# EAGLE design Wiring Harness Validator MX150L Rev1 (EAGLE 8.3.1)
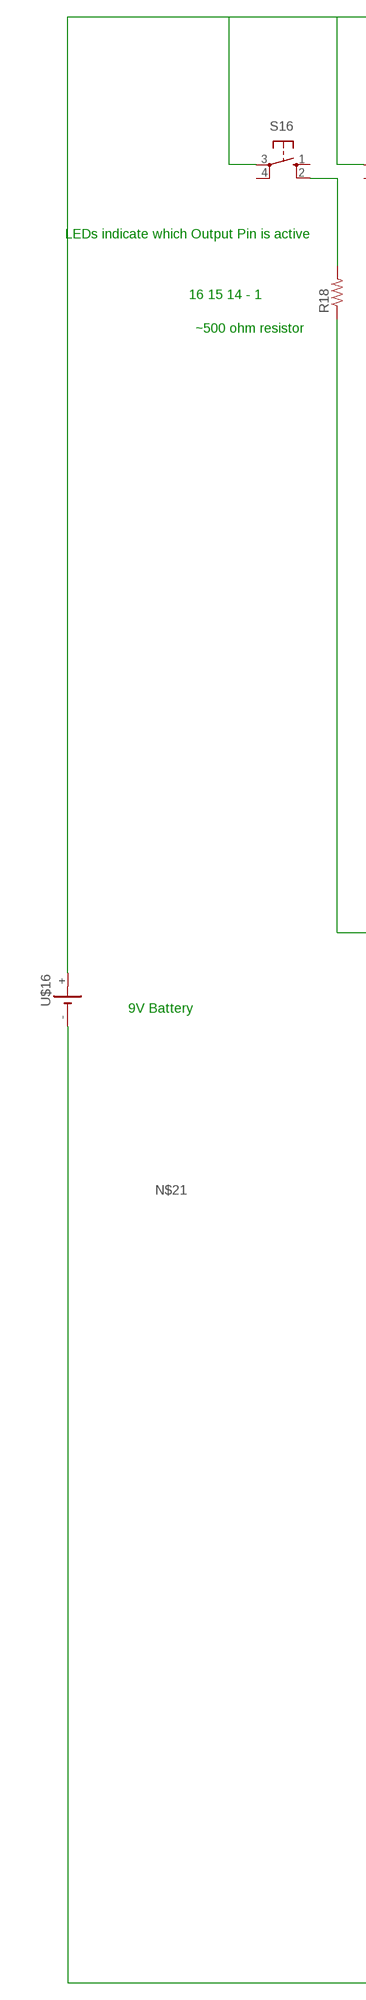
[diagram p0: schematic, sheet 1, part 1 of 2]
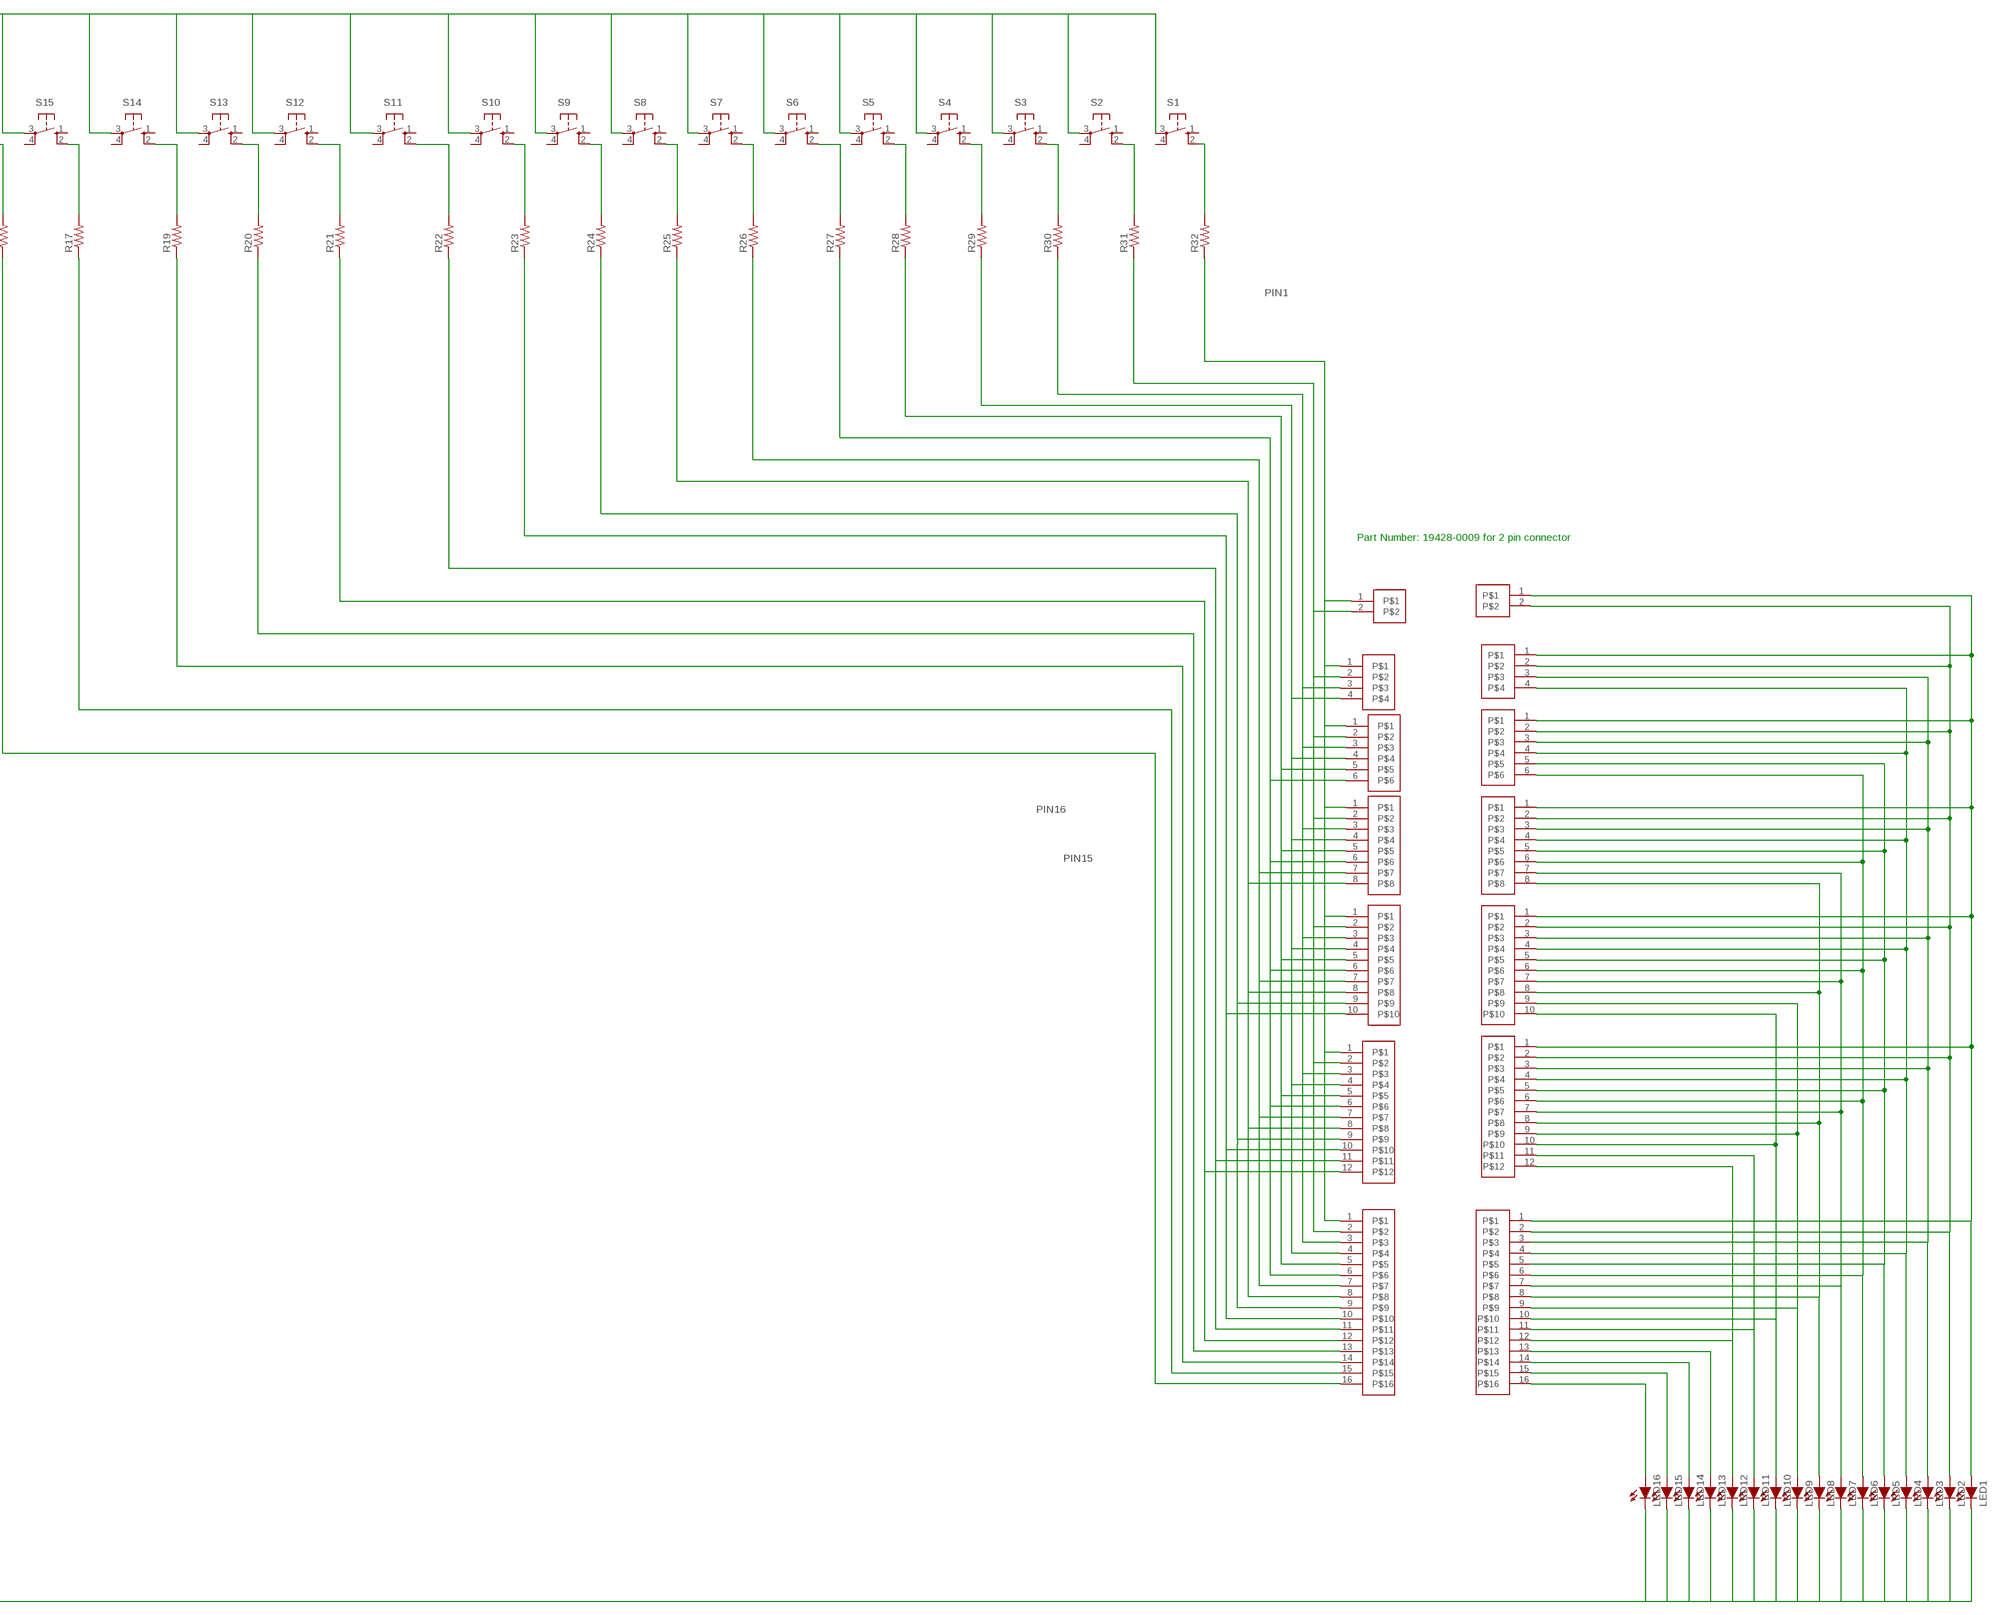
[diagram p1: schematic, sheet 1, part 2 of 2]

## Parts
LED1  LED-5MM  [LED-5MM]
LED2  LED-5MM  [LED-5MM]
LED3  LED-5MM  [LED-5MM]
LED4  LED-5MM  [LED-5MM]
LED5  LED-5MM  [LED-5MM]
LED6  LED-5MM  [LED-5MM]
LED7  LED-5MM  [LED-5MM]
LED8  LED-5MM  [LED-5MM]
LED9  LED-5MM  [LED-5MM]
LED10  LED-5MM  [LED-5MM]
LED11  LED-5MM  [LED-5MM]
LED12  LED-5MM  [LED-5MM]
LED13  LED-5MM  [LED-5MM]
LED14  LED-5MM  [LED-5MM]
LED15  LED-5MM  [LED-5MM]
LED16  LED-5MM  [LED-5MM]
R17  RESISTORPTH-1/2W  [AXIAL-0.5]
R18  RESISTORPTH-1/2W  [AXIAL-0.5]
R19  RESISTORPTH-1/2W  [AXIAL-0.5]
R20  RESISTORPTH-1/2W  [AXIAL-0.5]
R21  RESISTORPTH-1/2W  [AXIAL-0.5]
R22  RESISTORPTH-1/2W  [AXIAL-0.5]
R23  RESISTORPTH-1/2W  [AXIAL-0.5]
R24  RESISTORPTH-1/2W  [AXIAL-0.5]
R25  RESISTORPTH-1/2W  [AXIAL-0.5]
R26  RESISTORPTH-1/2W  [AXIAL-0.5]
R27  RESISTORPTH-1/2W  [AXIAL-0.5]
R28  RESISTORPTH-1/2W  [AXIAL-0.5]
R29  RESISTORPTH-1/2W  [AXIAL-0.5]
R30  RESISTORPTH-1/2W  [AXIAL-0.5]
R31  RESISTORPTH-1/2W  [AXIAL-0.5]
R32  RESISTORPTH-1/2W  [AXIAL-0.5]
S1  BTN_10-XX  [B3F-10XX]
S2  BTN_10-XX  [B3F-10XX]
S3  BTN_10-XX  [B3F-10XX]
S4  BTN_10-XX  [B3F-10XX]
S5  BTN_10-XX  [B3F-10XX]
S6  BTN_10-XX  [B3F-10XX]
S7  BTN_10-XX  [B3F-10XX]
S8  BTN_10-XX  [B3F-10XX]
S9  BTN_10-XX  [B3F-10XX]
S10  BTN_10-XX  [B3F-10XX]
S11  BTN_10-XX  [B3F-10XX]
S12  BTN_10-XX  [B3F-10XX]
S13  BTN_10-XX  [B3F-10XX]
S14  BTN_10-XX  [B3F-10XX]
S15  BTN_10-XX  [B3F-10XX]
S16  BTN_10-XX  [B3F-10XX]
U$1  MX150L-4PINS  [MX150L_VERTICAL-4]
U$2  MX150L-6PINS  [MX150L_VERTICAL-6]
U$3  MX150L-2PINS  [MX150L_VERTICAL-2]
U$4  MX150L-8PINS  [MX150L_VERTICAL-8]
U$5  MX150L-10PINS  [MX150L_VERTICAL-10]
U$6  MX150L-12PINS  [MX150L_VERTICAL-12]
U$7  MX150L-16PINS  [MX150L-VERTICAL-16]
U$8  MX150L-16PINS  [MX150L-VERTICAL-16]
U$9  MX150L-12PINS  [MX150L_VERTICAL-12]
U$10  MX150L-10PINS  [MX150L_VERTICAL-10]
U$11  MX150L-8PINS  [MX150L_VERTICAL-8]
U$12  MX150L-6PINS  [MX150L_VERTICAL-6]
U$13  MX150L-4PINS  [MX150L_VERTICAL-4]
U$14  MX150L-2PINS  [MX150L_VERTICAL-2]
U$16  1291-79  [1291-79]

## Nets
GND: LED1.A U$8.1 U$9.1 U$10.1 U$11.1 U$12.1 U$13.1 U$14.1
N$1: S1.3(P) S2.3(P) S3.3(P) S4.3(P) S5.3(P) S6.3(P) S7.3(P) S8.3(P) S9.3(P) S10.3(P) S11.3(P) S12.3(P) S13.3(P) S14.3(P) S15.3(P) S16.3(P) U$16.+
N$3: LED16.A U$8.16
N$4: LED8.A U$8.8 U$9.8 U$10.8 U$11.8
N$7: LED15.A U$8.15
N$8: LED14.A U$8.14
N$9: LED13.A U$8.13
N$10: LED12.A U$8.12 U$9.12
N$11: LED11.A U$8.11 U$9.11
N$12: LED10.A U$8.10 U$9.10 U$10.10
N$13: LED9.A U$8.9 U$9.9 U$10.9
N$15: LED7.A U$8.7 U$9.7 U$10.7 U$11.7
N$16: LED6.A U$8.6 U$9.6 U$10.6 U$11.6 U$12.6
N$17: LED5.A U$8.5 U$9.5 U$10.5 U$11.5 U$12.5
N$18: LED4.A U$8.4 U$9.4 U$10.4 U$11.4 U$12.4 U$13.4
N$19: LED3.A U$8.3 U$9.3 U$10.3 U$11.3 U$12.3 U$13.3
N$20: LED2.A U$8.2 U$9.2 U$10.2 U$11.2 U$12.2 U$13.2 U$14.2
N$21: LED1.K(C) LED2.K(C) LED3.K(C) LED4.K(C) LED5.K(C) LED6.K(C) LED7.K(C) LED8.K(C) LED9.K(C) LED10.K(C) LED11.K(C) LED12.K(C) LED13.K(C) LED14.K(C) LED15.K(C) LED16.K(C) U$16.-
N$40: R32.P$2 S1.2(S1)
N$53: R31.P$2 S2.2(S1)
N$54: R30.P$2 S3.2(S1)
N$55: R29.P$2 S4.2(S1)
N$56: R28.P$2 S5.2(S1)
N$57: R27.P$2 S6.2(S1)
N$58: R26.P$2 S7.2(S1)
N$59: R25.P$2 S8.2(S1)
N$60: R24.P$2 S9.2(S1)
N$61: R23.P$2 S10.2(S1)
N$62: R22.P$2 S11.2(S1)
N$63: R21.P$2 S12.2(S1)
N$64: R20.P$2 S13.2(S1)
N$65: R19.P$2 S14.2(S1)
N$66: R17.P$2 S15.2(S1)
N$67: R18.P$2 S16.2(S1)
PIN1: R32.P$1 U$1.1 U$2.1 U$3.1 U$4.1 U$5.1 U$6.1 U$7.1
PIN2: R31.P$1 U$1.2 U$2.2 U$3.2 U$4.2 U$5.2 U$6.2 U$7.2
PIN3: R30.P$1 U$1.3 U$2.3 U$4.3 U$5.3 U$6.3 U$7.3
PIN4: R29.P$1 U$1.4 U$2.4 U$4.4 U$5.4 U$6.4 U$7.4
PIN5: R28.P$1 U$2.5 U$4.5 U$5.5 U$6.5 U$7.5
PIN6: R27.P$1 U$2.6 U$4.6 U$5.6 U$6.6 U$7.6
PIN7: R26.P$1 U$4.7 U$5.7 U$6.7 U$7.7
PIN8: R25.P$1 U$4.8 U$5.8 U$6.8 U$7.8
PIN9: R24.P$1 U$5.9 U$6.9 U$7.9
PIN10: R23.P$1 U$5.10 U$6.10 U$7.10
PIN11: R22.P$1 U$6.11 U$7.11
PIN12: R21.P$1 U$6.12 U$7.12
PIN13: R20.P$1 U$7.13
PIN14: R19.P$1 U$7.14
PIN15: R17.P$1 U$7.15
PIN16: R18.P$1 U$7.16
Unconnected: S1.1(S) S1.4(P1) S2.1(S) S2.4(P1) S3.1(S) S3.4(P1) S4.1(S) S4.4(P1) S5.1(S) S5.4(P1) S6.1(S) S6.4(P1) S7.1(S) S7.4(P1) S8.1(S) S8.4(P1) S9.1(S) S9.4(P1) S10.1(S) S10.4(P1) S11.1(S) S11.4(P1) S12.1(S) S12.4(P1) S13.1(S) S13.4(P1) S14.1(S) S14.4(P1) S15.1(S) S15.4(P1) S16.1(S) S16.4(P1)

## Notes on the sheet
- LEDs indicate which Output Pin is active
- 16 15 14 - 1
- ~500 ohm resistor
- Part Number: 19428-0009 for 2 pin connector
- 9V Battery

## Library data of the parts
LED1-LED16 = HyTechDevices:LED: Light Emitting Diode (LED) Source: Dangerous Prototypes Eagle Library <https://github.com/DangerousPrototypes/Eagle_Part_Library>
R17-R32 = HyTechDevices:RESISTOR: Resistor Basic schematic elements and footprints for 0603, 1206, and PTH resistors.
S1-S16 = HyTechDevices:BTN_10-XX: Small momentary tactile push button; MPN: B3F-1000; OC_FARNELL: 176432; OC_NEWARK: 36M3542
U$1 U$13 = HyTechDevices:MX150L-4PINS
U$2 U$12 = HyTechDevices:MX150L-6PINS
U$3 U$14 = HyTechDevices:MX150L-2PINS
U$4 U$11 = HyTechDevices:MX150L-8PINS
U$5 U$10 = HyTechDevices:MX150L-10PINS
U$6 U$9 = HyTechDevices:MX150L-12PINS
U$7 U$8 = HyTechDevices:MX150L-16PINS
U$16 = HyTechDevices:1291-79: Keystone Electronics 9V 9 Volt battery holder 1291-79

## Board
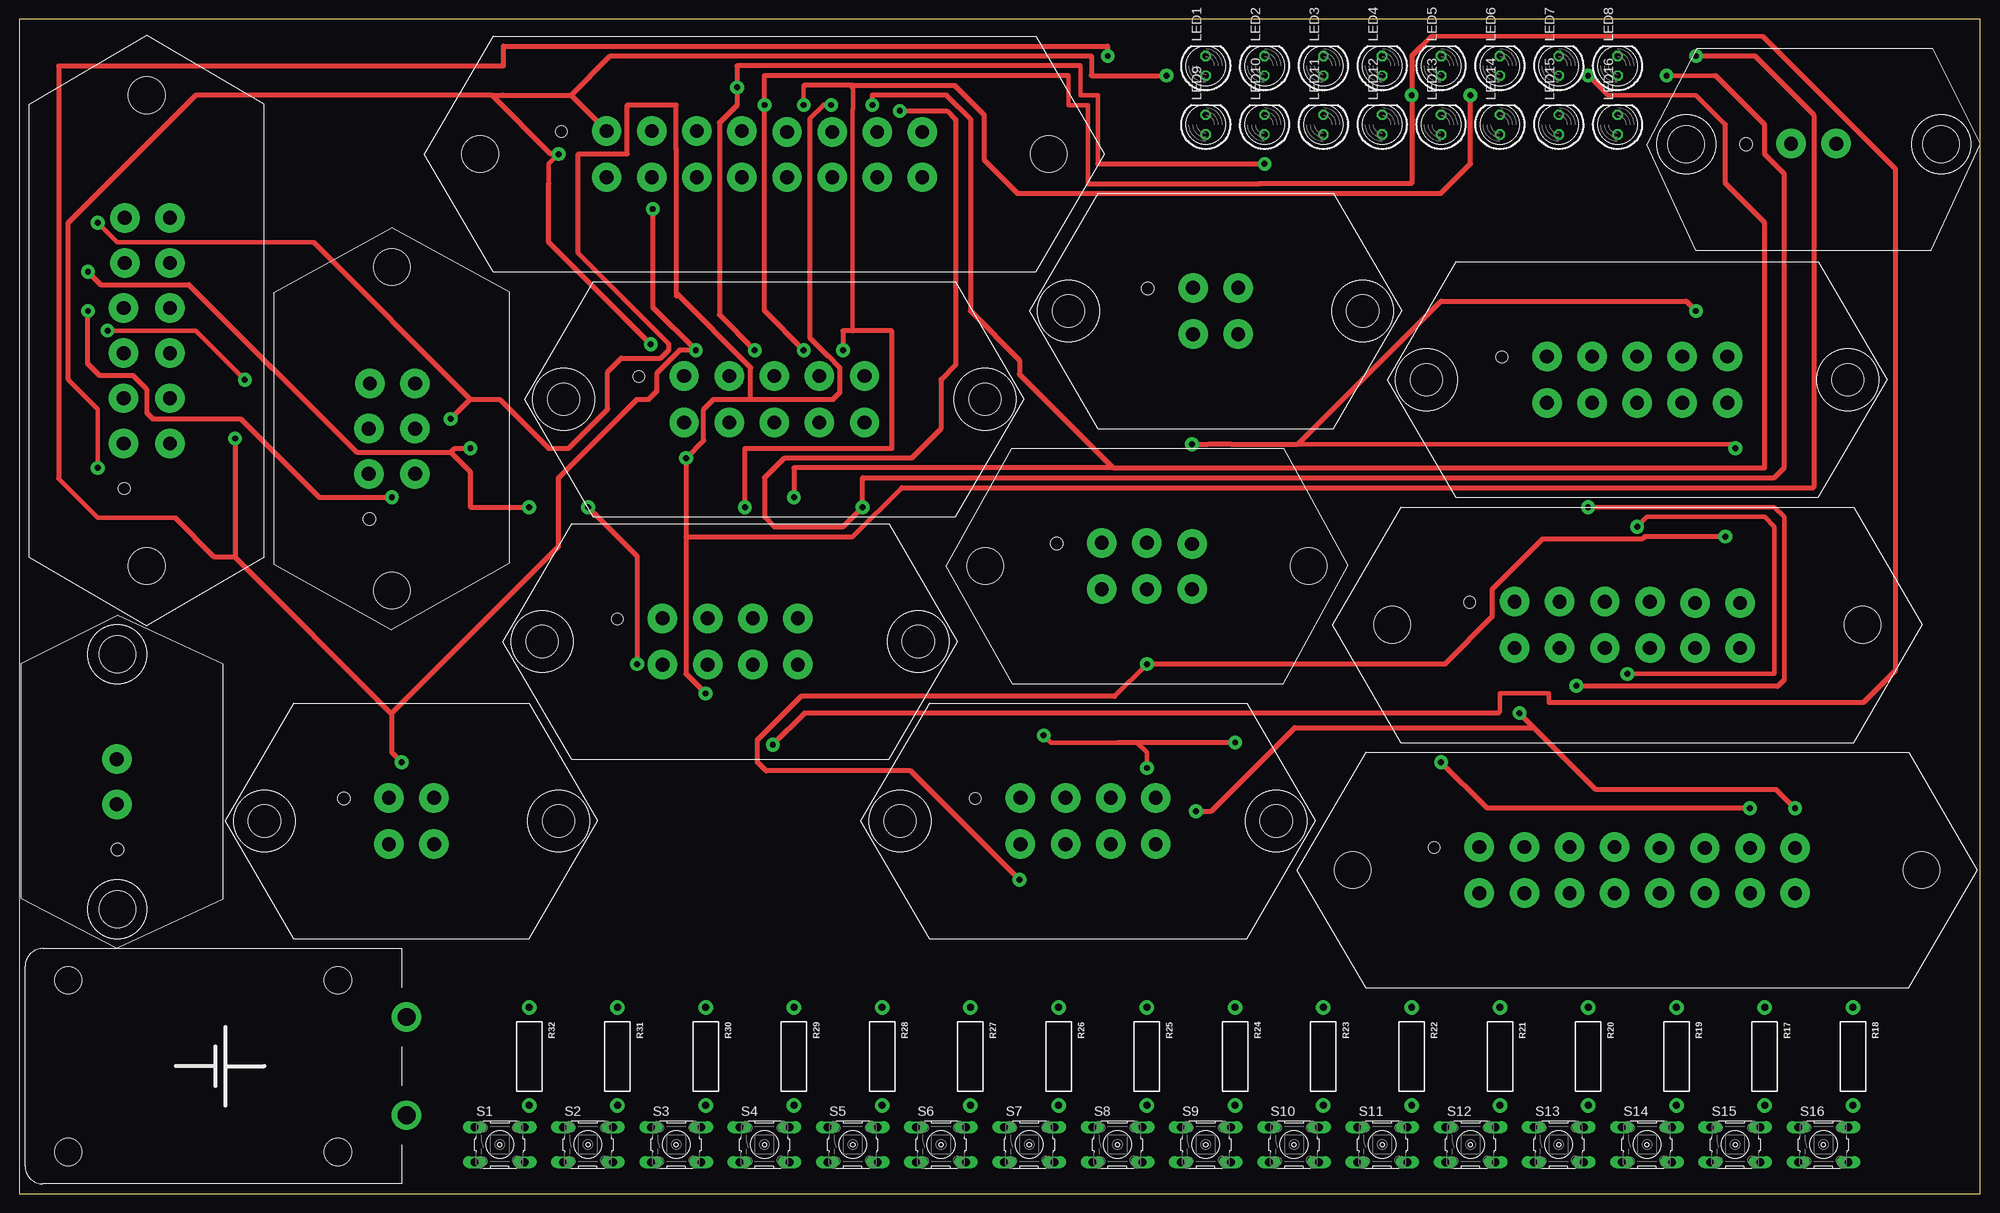
[diagram p2: board, top side]
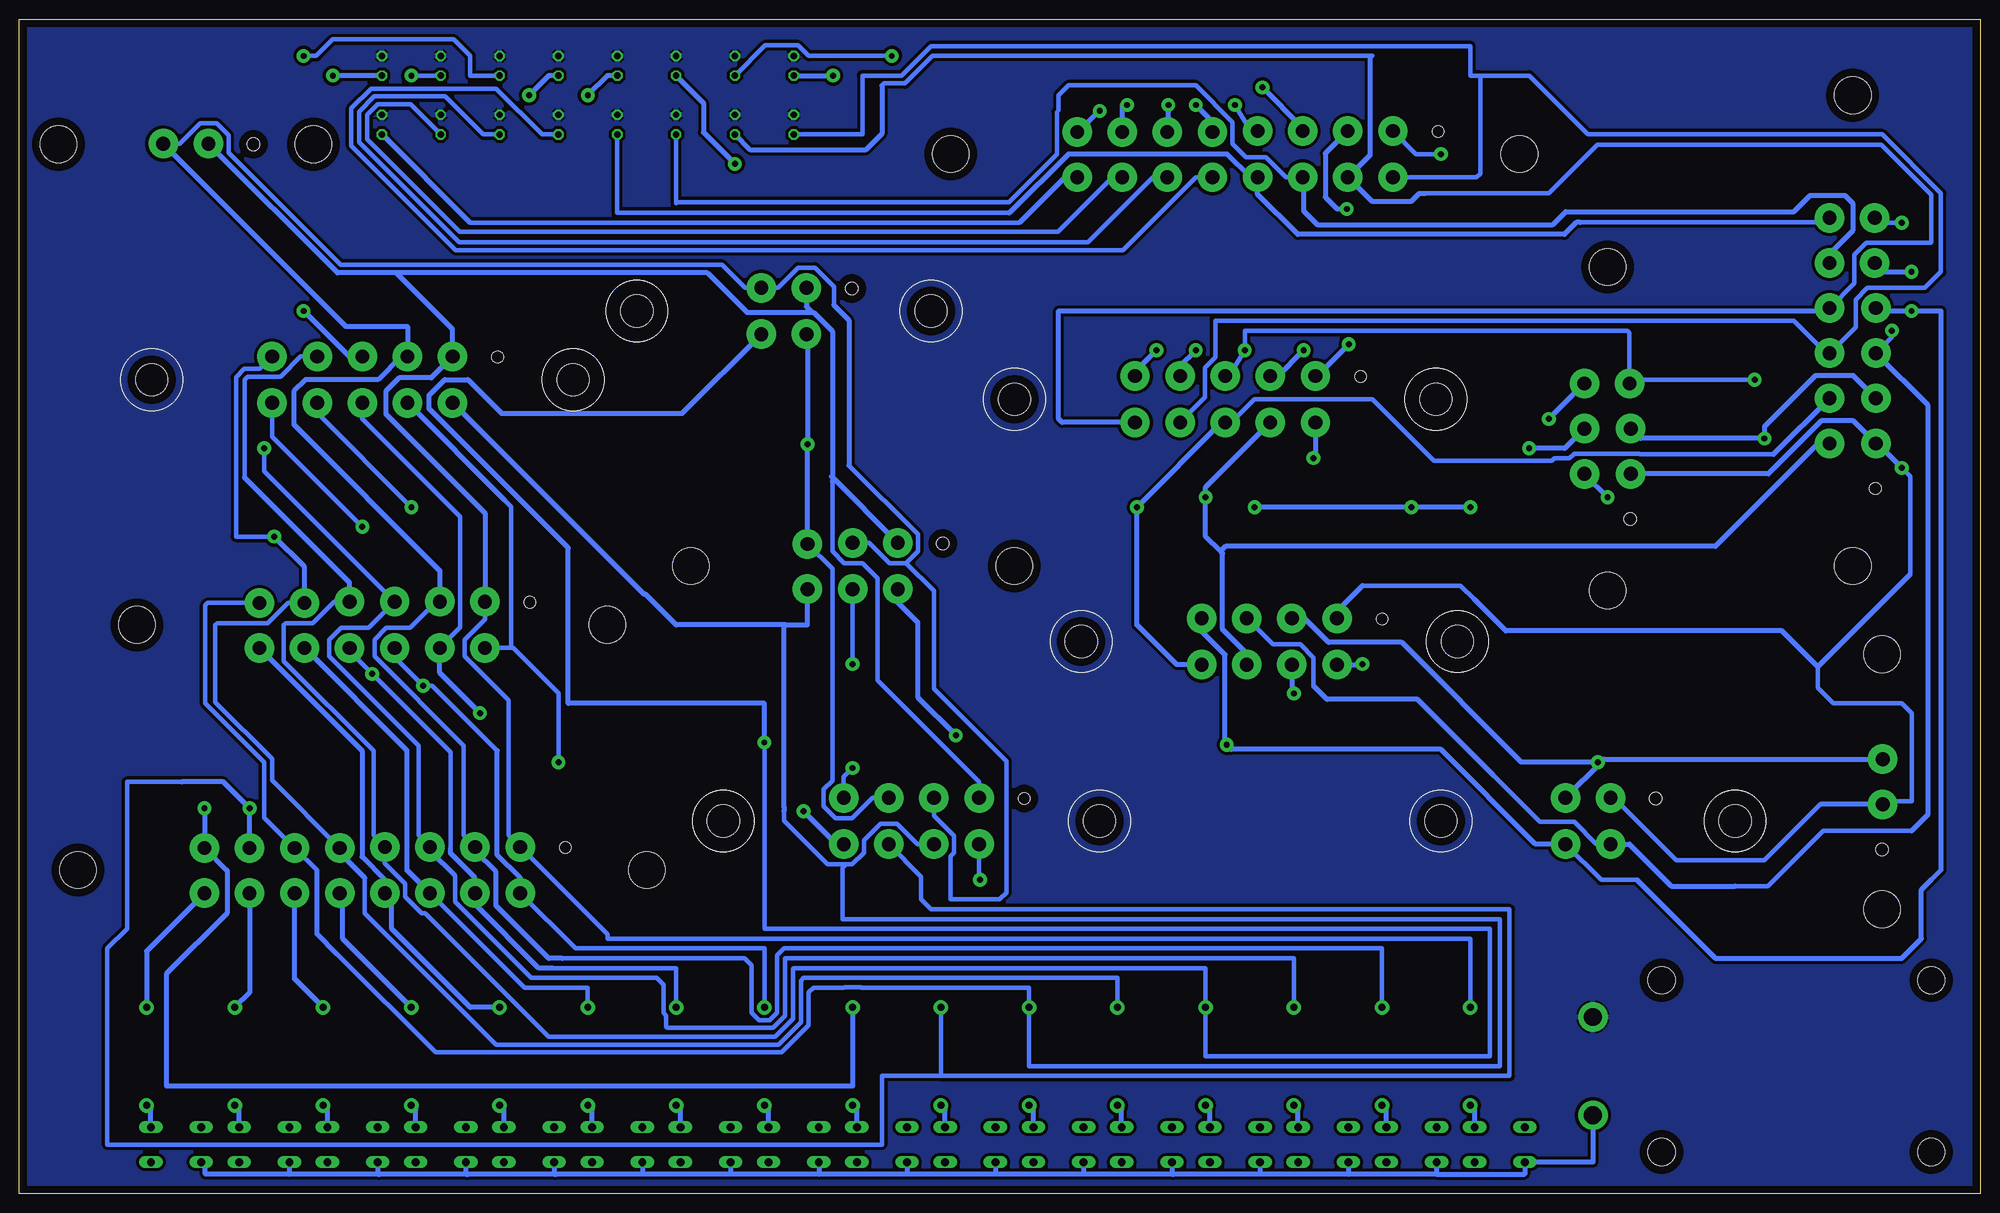
[diagram p3: board, bottom side, seen from below]

Size 253.98 x 152.07 mm. Coordinates in mm from the lower left corner, seen from the top.
Outline: 0,0 253.98,0 253.98,152.07 0,152.07 0,0
Copper layers (1*16): Top 0.035mm / dielectric 1.5mm / Bottom 0.035mm
Design rules "default *": minimum track width 6mil, minimum drill 0.35mm, track to track 16mil, track to pad 16mil, pad to pad 16mil, via to via 16mil, smd to smd 16mil, copper to edge 40mil, drill to drill 6mil, minimum pad ring 10mil, minimum via ring 8mil, stop-mask expansion 4mil, vias tented up to drill 0mil, thermal gap 10mil

### Footprints (pad centres in the part's own frame; a part is rotated, then mirrored left to right if it is on the bottom)
LED-5MM = drill 0.813 octagon: A -1.27,0; K 1.27,0
AXIAL-0.5 = drill 0.9 pad 1.88: P$1 -6.35,0; P$2 6.35,0
B3F-10XX = drill 1.016 long: 1 -3.251,2.261; 2 3.251,2.261; 3 -3.251,-2.261; 4 3.251,-2.261
MX150L_VERTICAL-4 = drill 1.778 pad 3.81: 1 -2.921,2.997; 2 2.921,2.997; 3 -2.921,-2.997; 4 2.921,-2.997 | hole 4.191: -19.05,0; 19.05,0 | hole 1.651: -8.763,2.921
MX150L_VERTICAL-6 = drill 1.778 pad 3.81: 1 -5.842,2.997; 2 0,2.997; 3 5.842,2.845; 4 -5.842,-2.997; 5 0,-2.997; 6 5.842,-2.997 | hole 1.651: -11.684,2.921 | hole 4.775: -20.955,0; 20.955,0
MX150L_VERTICAL-2 = drill 1.778 pad 3.81: 1 -2.921,0.076; 2 2.921,0.076 | hole 1.651: -8.763,0 | hole 4.775: -16.51,0; 16.51,0
MX150L_VERTICAL-8 = drill 1.778 pad 3.81: 1 -8.763,2.997; 2 -2.921,2.997; 3 2.921,2.997; 4 8.763,2.997; 5 -8.763,-2.997; 6 -2.921,-2.997; 7 2.921,-2.997; 8 8.763,-2.997 | hole 4.191: -24.371,0; 24.371,0 | hole 1.524: -14.605,2.921
MX150L_VERTICAL-10 = drill 1.778 pad 3.81: 1 -11.684,2.997; 2 -5.842,2.997; 3 0,2.997; 4 5.842,2.997; 5 11.684,2.997; 6 -11.684,-2.997; 7 -5.842,-2.997; 8 0,-2.997; 9 5.842,-2.997; 10 11.684,-2.997 | hole 4.191: -27.292,0; 27.292,0 | hole 1.524: -17.526,2.921
MX150L_VERTICAL-12 = drill 1.778 pad 3.81: 1 -14.605,2.997; 2 -8.763,2.997; 3 -2.921,2.997; 4 2.921,2.997; 5 8.763,2.845; 6 14.605,2.845; 7 -14.605,-2.997; 8 -8.763,-2.997; 9 -2.921,-2.997; 10 2.921,-2.997; 11 8.763,-2.997; 12 14.605,-2.997 | hole 1.524: -20.447,2.921 | hole 4.775: 30.48,0; -30.48,0
MX150L-VERTICAL-16 = drill 1.778 pad 3.81: 1 -20.447,2.997; 2 -14.605,2.997; 3 -8.763,2.997; 4 -2.921,2.997; 5 2.921,2.845; 6 8.763,2.845; 7 14.605,2.845; 8 20.447,2.845; 9 -20.447,-2.997; 10 -14.605,-2.997; 11 -8.763,-2.997; 12 -2.921,-2.997; 13 2.921,-2.997; 14 8.763,-2.997; 15 14.605,-2.997; 16 20.447,-2.997 | hole 1.524: -26.289,2.921 | hole 4.775: -36.83,0; 36.83,0
1291-79 = drill 2.286 pad 3.81: + 43.815,-6.35; - 43.815,6.35 | hole 3.556: 0,11.113; 0,-11.113; 34.925,-11.113; 34.925,11.113

### Placement (x,y rotation side)
LED1  153.67,146.05 90 top
LED2  161.29,146.05 90 top
LED3  168.91,146.05 90 top
LED4  176.53,146.05 90 top
LED5  184.15,146.05 90 top
LED6  191.77,146.05 90 top
LED7  199.39,146.05 90 top
LED8  207.01,146.05 90 top
LED9  153.67,138.43 90 top
LED10  161.29,138.43 90 top
LED11  168.91,138.43 90 top
LED12  176.53,138.43 90 top
LED13  184.15,138.43 90 top
LED14  191.77,138.43 90 top
LED15  199.39,138.43 90 top
LED16  207.01,138.43 90 top
R17  226.06,17.78 270 top
R18  237.49,17.78 270 top
R19  214.63,17.78 270 top
R20  203.2,17.78 270 top
R21  191.77,17.78 270 top
R22  180.34,17.78 270 top
R23  168.91,17.78 270 top
R24  157.48,17.78 270 top
R25  146.05,17.78 270 top
R26  134.62,17.78 270 top
R27  123.19,17.78 270 top
R28  111.76,17.78 270 top
R29  100.33,17.78 270 top
R30  88.9,17.78 270 top
R31  77.47,17.78 270 top
R32  66.04,17.78 270 top
S1  62.23,6.35 0 top
S2  73.66,6.35 0 top
S3  85.09,6.35 0 top
S4  96.52,6.35 0 top
S5  107.95,6.35 0 top
S6  119.38,6.35 0 top
S7  130.81,6.35 0 top
S8  142.24,6.35 0 top
S9  153.67,6.35 0 top
S10  165.1,6.35 0 top
S11  176.53,6.35 0 top
S12  187.96,6.35 0 top
S13  199.39,6.35 0 top
S14  210.82,6.35 0 top
S15  222.25,6.35 0 top
S16  233.68,6.35 0 top
U$1  154.94,114.3 0 top
U$2  146.05,81.28 0 top
U$3  232.41,135.89 0 top
U$4  138.43,48.26 0 top
U$5  209.55,105.41 0 top
U$6  208.28,73.66 0 top
U$7  209.55,41.91 0 top
U$8  96.52,134.62 0 top
U$9  16.51,111.76 90 top
U$10  97.79,102.87 0 top
U$11  92.08,71.5 0 top
U$12  48.26,99.06 90 top
U$13  50.8,48.26 0 top
U$14  12.7,53.34 90 top
U$16  6.35,16.51 0 top

### Tracks (layer width: path | path; a pad name or v marks a point on that pad's centre or on a via)
GND  (via drill 0.76 pad 1.78)
  Top 0.61: 68.58,130.81 68.58,133.35 v69.85,134.62 | v10.16,93.98 10.16,101.6 6.35,105.41
  Top 0.635: 6.35,105.41 6.35,125.73 22.86,142.24 61.21,142.24 | 61.21,142.24 62.61,142.24 | v81.79,109.98 68.58,123.19 68.58,130.81 | 62.61,142.24 | v148.59,144.78 138.85,144.78 138.85,147.32 76.53,147.32 71.45,142.24 | 75.99,137.62 U$8.1 71.45,142.24 | v69.85,134.62 68.83,134.62 61.21,142.24 | 62.61,142.24 71.45,142.24
  Bottom 0.61: v69.85,134.62 73.08,134.62 U$8.1 | 65.53,76.96 67.31,78.74 80.01,78.74 | 83.31,75.44 U$11.1 | U$14.1 12.24,50.8 8.89,50.8 8.89,62.23 10.16,63.5 19.05,63.5 21.04,65.49 21.04,68.23 | 20.7,50.42 27.94,43.18 39.37,43.18 47.45,51.26 U$13.1 | 9.08,80.2 9.08,92.9 v10.16,93.98
  Bottom 0.635: U$14.1 20.7,50.42 | v10.16,93.98 13.34,97.16 U$9.1 16.43,100.08 20.57,100.08 27.43,93.22 U$12.1 | 9.08,80.2 21.04,68.23 25.68,72.87 61.44,72.87 65.53,76.96 | LED1.A v148.59,144.78 | U$10.1 85.9,105.87 v81.79,109.98 | U$8.1 75.39,137.62 | 80.01,78.74 83.31,75.44
N$1
  Bottom 0.635: U$16.+ 50.16,4.09 S1.3 58.98,2.54 70.41,2.54 | S16.3 229.87,4.09 229.87,2.54 219,2.54 | 207.57,2.54 218.97,2.54 219,2.54 | 196.14,2.54 207.25,2.54 207.57,2.54 | 184.71,2.54 195.78,2.54 196.14,2.54 | 173.28,2.54 161.89,2.54 161.85,2.54 | 150.42,2.54 161.85,2.54 | 138.99,2.54 127.66,2.54 127.56,2.54 | 127.56,2.54 116.27,2.54 116.13,2.54 | 104.7,2.54 116.13,2.54 | 81.84,2.54 93.27,2.54 | S15.3 219,2.54 | S14.3 207.57,2.54 | S13.3 196.14,2.54 | S12.3 184.71,2.54 | 184.71,2.54 184.36,2.54 173.48,2.54 173.28,2.54 | S11.3 173.28,2.54 | S10.3 161.85,2.54 | S9.3 150.42,2.54 | 150.42,2.54 150.34,2.54 139,2.54 138.99,2.54 | S8.3 138.99,2.54 | S7.3 127.56,2.54 | S6.3 116.13,2.54 | S5.3 104.7,2.54 | 104.7,2.54 104.43,2.54 93.34,2.54 93.27,2.54 | S4.3 93.27,2.54 | S3.3 81.84,2.54 | 81.84,2.54 81.75,2.54 70.57,2.54 70.41,2.54 | S2.3 70.41,2.54
N$3
  Bottom 0.61: 124.46,125.73 195.58,125.73
  Bottom 0.635: U$8.16 118.57,131.62 124.46,125.73 | 195.58,125.73 LED16.A
N$4  (via drill 0.76 pad 1.78)
  Top 0.61: 219.71,144.78 v213.36,144.78
  Top 0.635: 219.71,144.78 226.06,138.43 226.06,134.62 228.6,132.08 228.6,93.98 227.33,92.71 109.22,92.71 v109.22,88.9 106.68,86.36 97.79,86.36 96.52,87.63 96.52,92.71 99.06,95.25 115.57,95.25 119.38,99.06 119.38,105.41 121.28,107.31 121.28,139.06 120.14,140.21 v114.05,140.21
  Bottom 0.61: 26.77,95.73 44.08,95.73 44.18,95.83 52.59,95.83 53.2,95.22 55.17,95.22 55.47,94.92 70.79,94.92 78.74,102.87 93.98,102.87 96.98,99.87 97.54,99.87 U$10.8
  Bottom 0.635: U$11.8 104.06,68.5 109.22,73.66 v109.22,88.9 98.25,99.87 97.54,99.87 | LED8.A v213.36,144.78 | U$9.8 26.77,95.73 | U$8.8 116.79,137.47 v114.05,140.21
N$7
  Bottom 0.61: U$8.15 112.4,131.62 119.47,124.55 196.94,124.55 208.95,136.56 208.95,139.7 207.58,141.07 203.3,141.07 LED15.A
N$8
  Bottom 0.61: U$8.14 107.14,131.62 115.57,123.19 197.02,123.19 209.97,136.14 209.97,140.12 208,142.09 198.82,142.09 193.89,137.16 LED14.A
N$9
  Bottom 0.61: U$8.13 101.58,131.62 111.03,122.17 197.44,122.17 210.98,135.72 210.98,140.54 208.42,143.1 192.22,143.1 186.27,137.16 LED13.A
N$10
  Bottom 0.61: 125.73,127 176.53,127 LED12.A | 19.69,126.36 U$9.12 20.1,125.77 51.82,125.77
  Bottom 0.635: 51.82,125.77 52.28,125.77 53.85,124.21 88.39,124.21 93.6,129.41 U$8.12 94.54,131.62 97.54,134.62 118.11,134.62 125.73,127
N$11
  Bottom 0.61: U$8.11 89.9,131.62 92.52,134.24 95.12,134.24 96.83,135.94 96.83,138.43 96.83,138.55 96.83,138.74 101.6,143.51 118.11,143.51 119.38,142.24 119.38,140.26 119.58,140.06 119.58,134.6 125.82,128.36 168.82,128.36 168.91,128.27 LED11.A
  Bottom 0.635: U$8.11 87.63,131.5 87.63,127.25 85.85,125.48 55.37,125.48 53.67,127.18 24.13,127.18 22.02,129.29 17.53,129.29 16.51,128.27 16.51,124.71 19.51,121.72 U$9.11
N$12
  Bottom 0.61: 71.88,129.54 55.88,129.54 49.61,135.81 12.78,135.81 6.35,129.37 6.35,123.19 6.4,123.14 14.75,123.14 16.28,121.61 16.28,117.91 U$9.10 | 78.74,147.32 78.99,147.32 135.72,147.32 139.28,143.76 141.99,143.76 142.24,143.51
  Bottom 0.635: U$9.10 19.51,114.78 19.98,114.3 119.38,114.3 119.38,100.33 118.92,99.87 U$10.10 | 142.24,143.51 142.24,137.28 144.39,135.13 159.26,135.13 LED10.A | 78.99,147.32 78.99,134.54 U$8.10 78.82,128.52 73.66,128.52 72.64,129.54 71.88,129.54
N$13
  Bottom 0.61: LED9.A 144.78,137.16 144.78,144.78 139.7,144.78 135.89,148.59 66.04,148.59 66.04,144.78 64.95,144.78 | 64.95,144.78 58.42,144.78 50.8,137.16 12.7,137.16 5.08,129.54 5.08,119.38 7.16,117.3 14.6,117.3 16.13,115.77 16.13,112.22 U$9.9 19.94,108.84 24.13,113.03 99.06,113.03 99.06,108.3 100.41,106.95 100.41,103.1 U$10.9 | U$8.9 65.23,131.62 64.77,132.08 64.77,144.6 64.95,144.78
  Bottom 0.635: U$9.9 19.51,110.03
N$15  (via drill 0.76 pad 1.78)
  Top 0.61: 220.98,138.43 217.17,142.24 205.74,142.24 v203.2,144.78
  Top 0.635: v100.33,90.17 100.33,93.98 141.67,93.98 | v110.49,140.97 110.49,142.24 120.11,142.24 123.17,139.18 123.17,114.32 129.54,107.95 129.54,106.11 141.67,93.98 | 141.67,93.98 226.06,93.98 226.06,125.73 220.98,130.81 220.98,138.43
  Bottom 0.61: v203.2,144.78 LED7.A
  Bottom 0.635: 98.4,83.16 98.15,82.91 98.15,73.08 95,69.93 U$11.7 | 98.4,83.16 100.33,85.09 v100.33,90.17 100.33,91.49 U$10.7 | U$9.7 20.96,97.16 34.29,83.82 97.74,83.82 98.4,83.16 | U$8.7 111.12,140.97 v110.49,140.97
N$16  (via drill 0.76 pad 1.78)
  Top 0.61: 104.14,140.97 102.36,139.19 | 38.1,123.19 12.7,123.19 v10.16,125.73 | 107.95,85.09 114.3,91.44 | 84.15,110.02 72.39,121.78
  Top 0.635: 58.42,102.87 38.1,123.19 | 58.42,102.87 v55.88,100.33 | 86.36,85.09 v86.36,95.25 88.65,97.54 88.65,101.6 89.92,102.87 94.74,102.87 | 86.36,85.09 86.36,67.31 v88.9,64.77 | 58.42,102.87 62.23,102.87 68.58,96.52 71.12,96.52 76.2,101.6 76.2,106.43 77.98,108.2 83.06,108.2 84.15,109.3 84.15,110.02 | 86.36,85.09 107.95,85.09 | 114.3,91.44 232.41,91.44 232.41,139.7 224.79,147.32 v217.17,147.32 | 72.39,121.78 72.39,134.62 78.74,134.62 78.74,140.97 85.09,140.97 85.09,135.2 85.13,135.16 85.13,116.59 | 85.13,116.59 85.13,116.24 | v105.16,140.97 104.14,140.97 | 102.36,139.19 102.36,110.84 104.7,108.5 104.72,108.5 106.26,106.96 106.26,103.72 105.41,102.87 94.74,102.87 | 94.74,102.87 94.74,106.97 85.13,116.59
  Bottom 0.61: LED6.A 195.58,144.78 195.58,147.32 197.74,149.48 213.36,149.48 215.52,147.32 v217.17,147.32 | v10.16,125.73 13.03,125.73 U$9.6
  Bottom 0.635: U$12.6 51.31,104.9 v55.88,100.33 | U$10.6 86.11,95.5 v86.36,95.25 | U$11.6 89.15,65.02 v88.9,64.77 | U$8.6 105.16,137.59 v105.16,140.97
N$17  (via drill 0.76 pad 1.78)
  Top 0.61: v101.6,140.97 101.6,143.49 101.62,143.51 | 107.95,111.73 107.95,140.41 107.97,140.43 107.97,143.51 107.98,143.51
  Top 0.635: v187.96,142.24 187.96,133.35 184.15,129.54 129.29,129.54 124.97,133.86 124.97,139.7 121.16,143.51 107.98,143.51 | 107.98,143.51 101.62,143.51 | v66.04,88.9 58.42,88.9 58.42,93.47 55.88,96.01 | v106.68,109.22 106.68,111.73 107.95,111.73 113.03,111.73 113.03,96.52 93.98,96.52 v93.98,88.9 | 107.8,143.33 107.98,143.51 | v80.01,68.58 80.01,82.55 v73.66,88.9 | 55.88,96.01 43.69,96.01 21.97,117.73 10.54,117.73 v8.89,119.38 | 55.88,96.01 56.39,96.52 v58.42,96.52
  Bottom 0.635: LED5.A 185.42,144.78 v187.96,142.24 | U$8.5 99.44,138.81 v101.6,140.97 | U$10.5 109.47,106.43 v106.68,109.22 | U$9.5 13.67,119.38 v8.89,119.38 | U$12.5 53.8,96.52 v58.42,96.52 | v66.04,88.9 v73.66,88.9 v93.98,88.9 | U$11.5 80.09,68.5 v80.01,68.58
N$18  (via drill 0.76 pad 1.78)
  Top 0.61: 138.43,130.72 138.43,140.97 135.89,140.97 135.89,144.78 | 181.61,148.59 182.88,149.86 225.81,149.86 | 198.12,63.59 198.12,64.77 191.77,64.77 191.77,62.42 191.58,62.23
  Top 0.635: v101.6,109.22 96.52,114.3 v96.52,140.97 96.52,144.78 135.89,144.78 | 191.58,62.23 101.71,62.23 v97.59,58.12 | 198.12,63.59 238.85,63.59 242.95,67.69 242.95,132.72 225.81,149.86 | 181.61,148.59 180.34,147.32 v180.34,142.24 180.34,130.81 160.67,130.81 160.58,130.72 138.43,130.72 | v8.89,114.3 8.89,107.44 10.41,105.92 14.73,105.92 16.51,104.14 16.51,101.09 17.27,100.33 28.7,100.33 38.86,90.17 v48.26,90.17
  Bottom 0.61: 5.08,41.91 6.35,40.64 | 44.45,40.64 49.1,40.64 U$13.4
  Bottom 0.635: U$11.4 100.84,72.82 97.81,69.8 97.81,58.34 v97.59,58.12 97.02,57.55 69.88,57.55 57.6,45.26 U$13.4 | 44.45,40.64 34.29,30.48 10.16,30.48 7.62,33.02 7.62,39.37 6.35,40.64 | U$8.4 94.44,137.62 v96.52,140.97 | LED4.A 177.8,144.78 v180.34,142.24 | U$10.4 103.63,107.19 v101.6,109.22 | U$12.4 51.26,93.17 v48.26,90.17 | U$9.4 13.51,114.3 v8.89,114.3 5.08,114.3 5.08,41.91
N$19  (via drill 0.76 pad 1.78)
  Top 0.61: v29.21,105.41 22.86,111.76 v11.43,111.76 | 139.7,133.35 139.7,142.24 137.41,142.24 137.41,146.05
  Top 0.635: 137.41,146.05 92.96,146.05 v92.96,143.26 92.96,140.97 90.68,138.68 90.68,113.79 v95.25,109.22 | 139.7,133.35 v161.29,133.35
  Bottom 0.61: v95.25,109.22 95.25,111.76 45.72,111.76 45.41,111.45 U$12.3 44.91,105.41 v29.21,105.41 | U$9.3 11.43,110.92 v11.43,111.76 | U$11.3 91.62,71.12 88.07,71.12 86.36,69.41 86.36,65.75 | 47.78,45.26 49.73,45.26 52.6,48.13 57.02,48.13 63.07,54.18 | 8.89,46.99 20.32,46.99 27.48,39.83 31.75,39.83
  Bottom 0.635: 31.75,39.83 40,39.83 45.44,45.26 47.78,45.26 U$13.3 | v161.29,133.35 165.35,137.41 165.35,141.22 LED3.A | U$10.3 97.33,105.87 v95.25,109.22 | 8.89,46.99 6.82,49.06 6.82,102.15 U$9.3 | U$8.3 87.76,138.05 v92.96,143.26 | 86.36,65.75 84.61,64 72.89,64 63.07,54.18
N$20  (via drill 0.76 pad 1.78)
  Top 0.61: 20.2,87.51 10.16,87.51 5.08,92.59
  Top 0.635: 48.26,62.11 48.26,62.23 69.85,83.82 69.85,92.71 80.01,102.87 81.53,102.87 82.55,103.89 82.55,106.22 85.55,109.22 v87.63,109.22 82.04,114.81 v82.04,127.51 | 48.26,62.11 48.26,57.15 v49.53,55.88 | v27.94,97.79 27.94,82.43 | 27.94,82.43 48.26,62.11 | 27.94,82.43 25.27,82.43 20.2,87.51 | v140.97,147.32 140.97,148.59 62.72,148.59 62.72,146.05 5.08,146.05 5.08,92.59
  Bottom 0.61: v140.97,147.32 151.73,147.32 153.1,148.69 157.38,148.69 LED2.A | 87.52,74.5 U$11.2
  Bottom 0.635: U$14.2 48.72,56.26 49.1,55.88 | 49.1,55.88 U$13.2 | 49.1,55.88 v49.53,55.88 59.44,55.88 74.93,71.37 84.4,71.37 87.52,74.5 | U$10.2 90.98,105.87 v87.63,109.22 | U$12.2 43.99,97.79 v27.94,97.79 27.94,99.31 21.34,105.92 16.43,105.92 U$9.2 | U$8.2 84.84,134.7 84.84,129.03 83.31,127.51 v82.04,127.51
N$21
  pour Bottom (isolate 0.305): 0,0 254,0 254,152.4 0,152.4
N$40
  Bottom 0.635: S1.2 65.48,10.87 R32.P$2
N$53
  Bottom 0.635: S2.2 76.91,10.87 R31.P$2
N$54
  Bottom 0.635: S3.2 88.34,10.87 R30.P$2
N$55
  Bottom 0.635: S4.2 99.77,10.87 R29.P$2
N$56
  Bottom 0.635: S5.2 111.2,10.87 R28.P$2
N$57
  Bottom 0.635: S6.2 122.63,10.87 R27.P$2
N$58
  Bottom 0.635: S7.2 134.06,10.87 R26.P$2
N$59
  Bottom 0.635: S8.2 145.49,10.87 R25.P$2
N$60
  Bottom 0.635: S9.2 156.92,10.87 R24.P$2
N$61
  Bottom 0.635: S10.2 168.35,10.87 R23.P$2
N$62
  Bottom 0.635: S11.2 179.78,10.87 R22.P$2
N$63
  Bottom 0.635: S12.2 191.21,10.87 R21.P$2
N$64
  Bottom 0.635: S13.2 202.64,10.87 R20.P$2
N$65
  Bottom 0.635: S14.2 214.07,10.87 R19.P$2
N$66
  Bottom 0.635: S15.2 225.5,10.87 R17.P$2
N$67
  Bottom 0.635: S16.2 236.93,10.87 R18.P$2
PIN1
  Bottom 0.61: U$4.1 129.67,53.36 142.82,66.52 142.82,79.71 144.78,81.66 147.13,81.66 148.67,83.19 148.67,92.2 148.67,92.73 148.81,92.88 | R32.P$1 66.04,33.02 177.8,33.02 177.8,33.6 U$7.1 190.59,46.39 190.59,63.88 196.29,69.58 196.29,71.75 193.67,74.36 U$6.1
  Bottom 0.635: U$6.1 193.67,88.14 206.5,100.97 206.5,103.89 204.75,105.64 200.64,105.64 U$5.1 197.87,111.96 205.15,119.25 | U$1.1 152.02,114.86 151.3,114.14 | 148.81,92.88 U$2.1 | 205.15,119.25 164.85,119.25 159.73,114.14 151.3,114.14 | 205.15,119.25 212.77,119.25 U$3.1 | 148.67,92.2 148.67,111.67 151.13,114.14 151.3,114.14
PIN2
  Bottom 0.61: U$3.2 233.19,135.97 230.57,138.58 228.41,138.58 226.87,137.05 226.87,134.81 212.35,120.28 162.94,120.28 159.96,117.3 U$1.2 155.72,117.3 153.1,119.91 150.94,119.91 148.48,117.45 148.48,115.06 | 139.12,81.66 137.59,83.19 137.59,85.36 146.51,94.28 | 139.12,81.66 141.29,81.66 143.91,84.28 U$2.2 | 139.12,81.66 135.51,78.05 135.51,65.41 126.12,56.03 126.12,38.98 127,38.1 133.35,38.1 133.35,43.72 132.89,44.18 132.89,46.35 135.51,48.96 U$4.2 | R31.P$1 77.47,31.75 154.94,31.75 155.83,30.86 155.83,23.45 156.8,22.48 158.16,22.48 159.13,23.45 159.13,29.59 160.02,30.48 183.64,30.48 | U$7.2 196.43,46.39 196.43,58.03 207.97,69.58 207.97,71.75 206.44,73.28 203.36,73.28 199.52,77.12
  Bottom 0.635: U$6.2 199.52,77.12 199.52,80.7 218.44,99.62 218.44,103.89 216.92,105.41 207.52,105.41 204.52,108.41 U$5.2 203.71,112.27 211.63,112.27 U$3.2 | 183.64,30.48 185.42,30.48 192.24,37.3 192.24,41.66 194.95,44.36 U$7.2 | 148.48,115.06 146.51,113.1 146.51,94.28
PIN3  (via drill 0.76 pad 1.78)
  Top 0.61: v222.25,96.52 221.74,97.03 165.61,97.03
  Top 0.635: v217.17,114.3 215.9,115.57 184.15,115.57 165.61,97.03 156.97,97.03 153.92,97.03 151.92,97.03 v151.89,97.05
  Bottom 0.61: U$2.3 148.67,80.9 148.67,53.48 149.81,52.34 149.81,50.17 148.28,48.64 146.11,48.64 143.49,51.26 U$4.3 | R30.P$1 88.9,30.48 154.77,30.48 154.77,23.07 156.38,21.46 170.05,21.46 170.18,21.59 170.18,23.07 170.56,23.45 170.56,27.05 171.45,27.94 187.67,27.94 197.56,37.83 197.56,41.15 | U$7.3 202.27,46.39 202.27,58.03 213.82,69.58 213.82,71.75 212.28,73.28 208.74,73.28 U$6.3 222.25,93.55 v222.25,96.52
  Bottom 0.635: U$2.3 v151.89,97.05 151.89,111.18 U$1.3 | U$5.3 211.28,108.41 v217.17,114.3 | 197.56,41.15 200.79,44.37 U$7.3
PIN4  (via drill 0.76 pad 1.78)
  Top 0.61: 142.24,58.42 133.6,58.42 v132.68,59.35 | 144.78,58.42 146.05,57.15 v146.05,55.12
  Top 0.635: v157.48,58.42 144.78,58.42 142.24,58.42
  Bottom 0.61: v157.48,58.42 157.48,34.29 63.5,34.29 63.5,17.78 100.33,17.78 R29.P$1 100.33,29.21 153.67,29.21 153.76,29.12 153.76,22.64 156.08,20.32 185.42,20.32 201.4,36.3 201.87,36.3 204.01,38.44 204.01,40.16 206.63,42.77 U$7.4 208.11,46.39 208.11,57.35 219.71,68.94 219.71,73.66 219.48,73.89 215.96,73.89 213.19,76.66 U$6.4 | 224.79,92.71 224.79,105.41 224.41,105.79 220.15,105.79 217.53,108.41 U$5.4 | v146.05,55.12 147.19,53.98 U$4.4
  Bottom 0.635: U$2.4 140.21,76.59 137.62,74 137.62,64.29 v132.68,59.35 | U$1.4 168.12,101.05 191.52,101.05 195.88,105.41 198.88,105.41 200.91,103.38 200.91,101.65 182.88,83.62 182.88,63.5 157.48,63.5 v157.48,58.42 | U$6.4 211.2,79.12 224.79,92.71
PIN5  (via drill 0.76 pad 1.78)
  Top 0.61: v146.05,68.58 141.87,64.4
  Top 0.635: v146.05,68.58 184.66,68.58 190.75,74.68 190.75,78.23 197.27,84.75 210.22,84.75 210.56,85.09 v220.98,85.09 | 141.87,64.4 101.23,64.4 95.62,58.79 95.62,55.86 96.73,54.74 115.44,54.74 v129.54,40.64
  Bottom 0.61: v146.05,68.58 U$2.5 | U$4.5 129.67,40.77 v129.54,40.64 | R28.P$1 111.76,27.94 152.4,27.94 152.74,27.6 152.74,22.22 155.66,19.3 192.21,19.3 209.25,36.34 209.25,40.89 | U$7.5 221.23,53.52 221.23,56.3 228.6,63.67 228.6,73.66 228.37,73.89 221.8,73.89 219.19,76.5 U$6.5 | v220.98,85.09 225.92,85.09 225.92,105.72 224.83,106.81 222.83,106.81 U$5.5
  Bottom 0.635: U$6.5 217.04,81.15 v220.98,85.09 | 209.25,40.89 212.47,44.12 U$7.5
PIN6
  Bottom 0.61: U$4.6 137.65,45.26 140.27,47.88 142.44,47.88 144.58,45.74 144.58,44.18 146.11,42.65 146.88,42.65 | 146.88,42.65 149.33,42.65 154.94,48.26 154.94,50.1 | 146.88,42.65 147.32,42.21 147.32,35.56 62.23,35.56 62.23,16.51 123.19,16.51 R27.P$1 123.19,26.67 144.94,26.67 144.98,26.71 147.12,26.71 147.16,26.67 151.13,26.67 151.72,26.07 151.72,21.8 155.24,18.29 200.08,18.29 212.82,31.02 | 215.43,41.87 U$7.6 222.25,48.69 222.25,55.88 229.87,63.5 229.87,76.2 229.57,76.5 U$6.6
  Bottom 0.635: U$2.6 151.89,73.64 151.91,73.66 154.67,73.66 | U$5.6 173.13,77.67 172.92,77.67 168.91,73.66 154.67,73.66 | 154.94,49.53 154.94,50.1 154.94,73.39 154.67,73.66 | 212.82,31.02 215.43,33.63 215.43,41.87
PIN7  (via drill 0.76 pad 1.78)
  Top 0.635: v184.15,55.88 190.12,49.91 v224.13,49.91 224.16,49.91
  Bottom 0.61: R26.P$1 134.62,15.24 | 134.62,15.24 60.96,15.24 60.96,36.83 135.89,36.83 137.16,38.1 137.16,41.07 U$4.7 | 134.62,15.24 142.24,15.24 142.24,6.35 242.57,6.35 242.57,31.75 240.03,34.29 240.03,53.34 232.92,53.34 | v184.15,55.88 184.15,64.77 190.04,70.66 190.28,70.66 | 190.28,70.66 U$6.7 | 191.16,89.86 190.28,88.98 190.28,70.66
  Bottom 0.635: U$5.7 191.16,89.86 | U$7.7 224.16,49.89 v224.13,49.91 227.56,53.34 232.92,53.34
PIN8  (via drill 0.76 pad 1.78)
  Top 0.635: 196.19,60.35 v194.31,62.23 | v152.4,49.53 154.38,49.53 165.2,60.35 196.19,60.35 | 196.19,60.35 204.22,52.32 227.58,52.32 v230,49.91
  Bottom 0.61: U$6.8 196.85,73.33 196.85,87.63 209.55,100.33 U$5.8
  Bottom 0.635: R25.P$1 146.05,13.97 234.95,13.97 234.95,28.45 227.08,36.32 227.08,41.91 227.15,41.91 U$7.8 v230,49.91 230,50.04 | U$6.8 199.52,67.44 v194.31,62.23 | U$4.8 148.13,45.26 v152.4,49.53
PIN9  (via drill 0.76 pad 1.78)
  Top 0.61: 228.6,66.55 228.6,87.63 227.33,88.9 v203.2,88.9
  Top 0.635: 228.6,66.55 227.75,65.7 201.77,65.7 v201.68,65.79
  Bottom 0.61: R24.P$1 157.48,31.75 181.94,31.75 U$7.9 | U$6.9 205.36,69.47 v201.68,65.79 200.48,65.79 192.06,57.37 | v203.2,88.9 215.39,101.09 U$5.9
  Bottom 0.635: U$7.9 189.1,40.89 192.06,43.85 192.06,57.37
PIN10  (via drill 0.76 pad 1.78)
  Top 0.61: v208.28,67.31 227.33,67.31 227.33,86.36 226.06,87.63 210.82,87.63 v209.55,86.36
  Bottom 0.61: R23.P$1 168.91,29.21 184.91,29.21 | U$6.10 211.2,70.23 v208.28,67.31 198.12,57.15 198.12,44.7 | v209.55,86.36 221.23,98.04 U$5.10
  Bottom 0.635: 184.91,29.21 186.69,29.21 194.95,37.47 U$7.10 194.95,40.89 198.12,44.07 198.12,44.7
PIN11
  Bottom 0.61: R22.P$1 180.34,26.67 188.54,26.67 U$7.11
  Bottom 0.635: U$6.11 203.75,57.37 203.75,41.87 U$7.11 200.66,38.79
PIN12
  Bottom 0.635: U$6.12 209.59,57.37 209.59,43.6 206.63,40.64 U$7.12 205.74,38.02 205.74,34.29 195.58,24.13 R21.P$1
PIN13
  Bottom 0.635: U$7.13 212.09,38.53 212.09,33.02 R20.P$1
PIN14
  Bottom 0.635: R19.P$1 218.31,27.81 U$7.14
PIN15
  Bottom 0.635: U$7.15 224.16,26.04 R17.P$1
PIN16
  Bottom 0.635: U$7.16 237.49,31.42 R18.P$1

### Text on the board
tDocu: 2018 Wiring Harness Validator